# EAGLE design bldc_shield_eagle_layout (EAGLE 7.5.0)

## Sheet 1 of 3
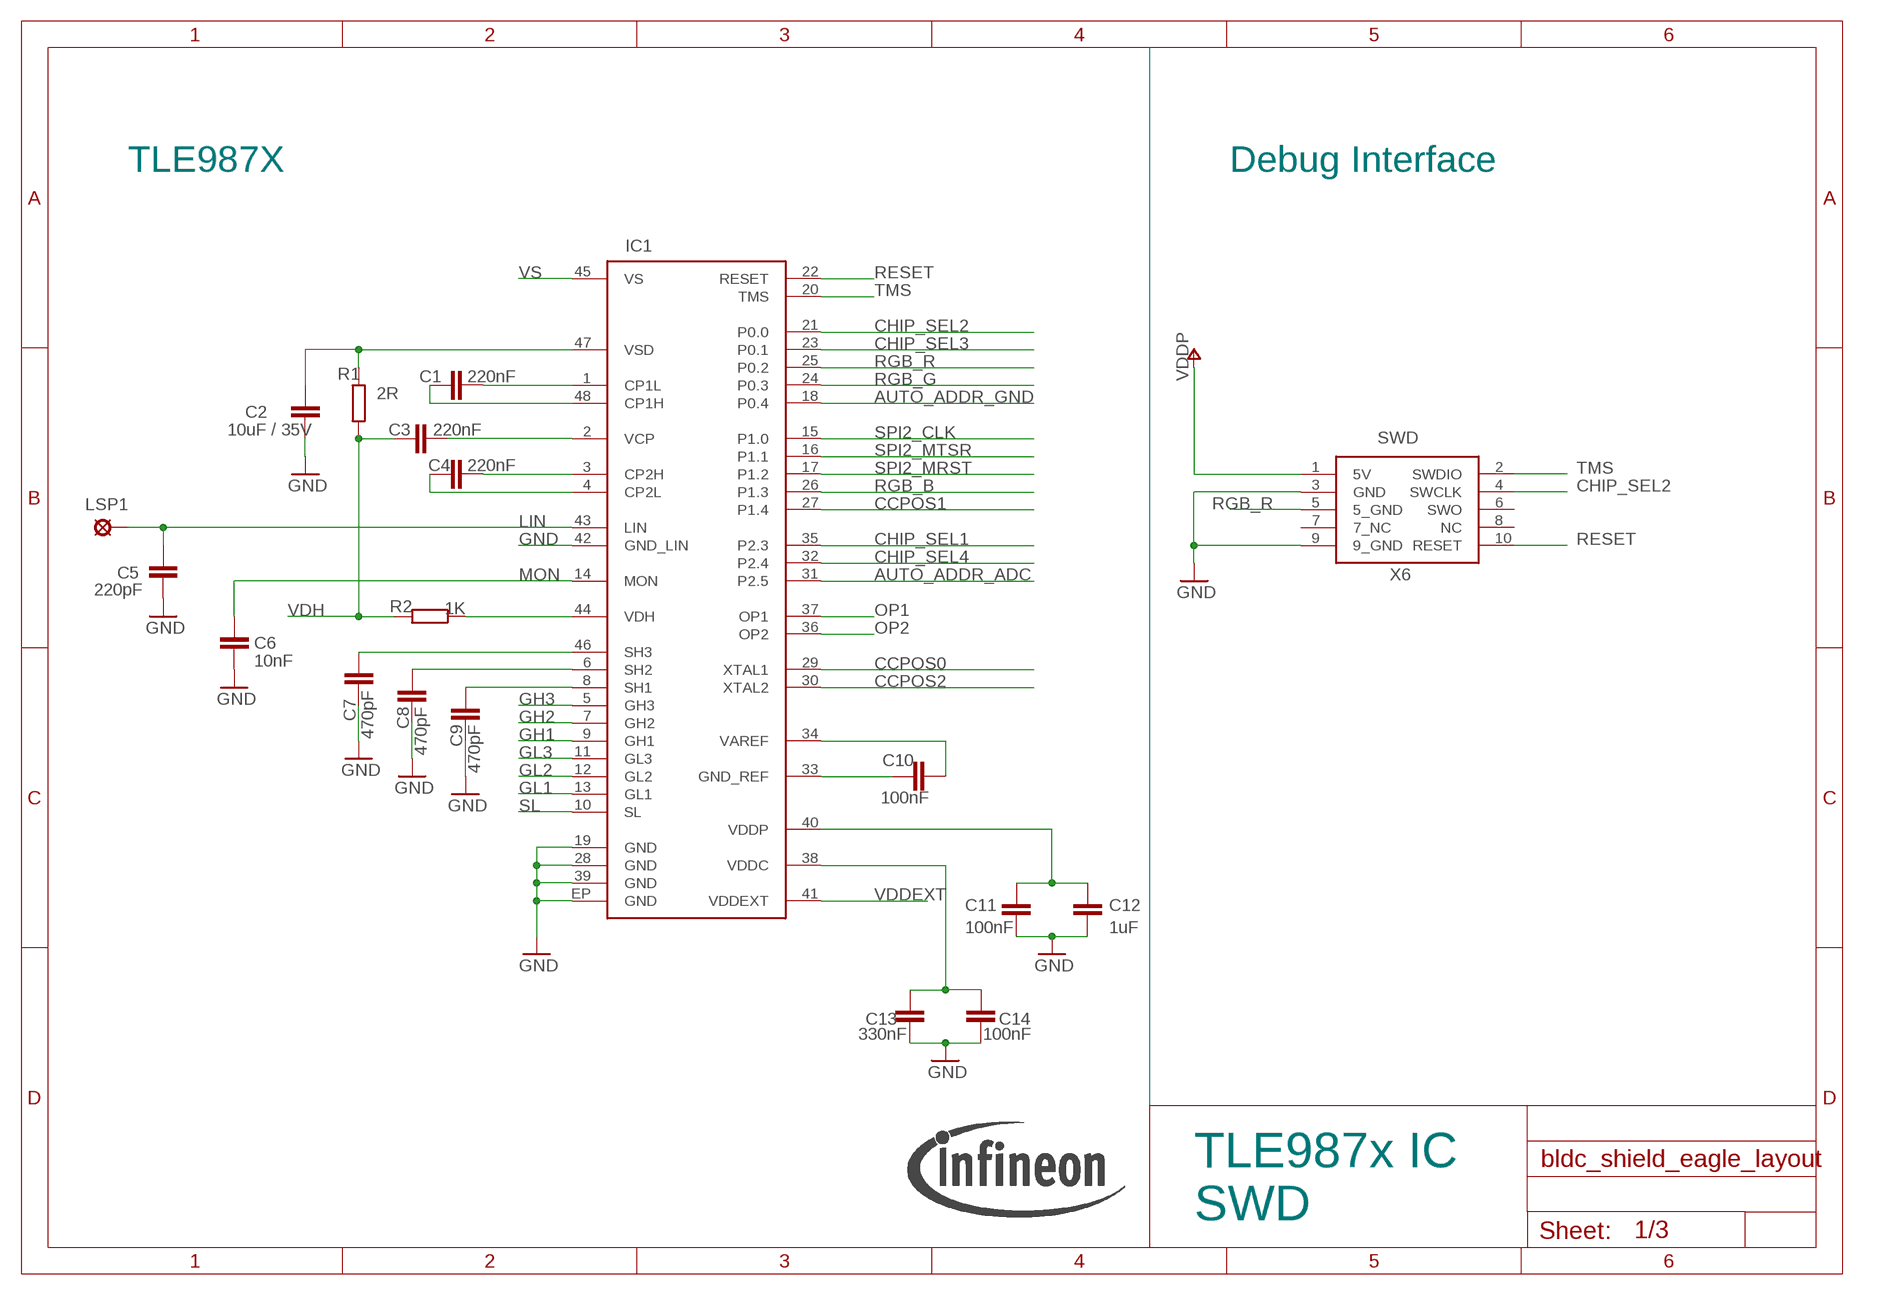
[diagram p0: schematic, sheet 1]

### Parts
C1  220nF  C-EUC0603  [C0603]
C2  10uF / 35V  C-EUC1210  [C1210]
C3  220nF  C-EUC0603  [C0603]
C4  220nF  C-EUC0603  [C0603]
C5  220pF  C-EUC0603  [C0603]
C6  10nF  C-EUC0603  [C0603]
C7  470pF  C-EUC0603  [C0603]
C8  470pF  C-EUC0603  [C0603]
C9  470pF  C-EUC0603  [C0603]
C10  100nF  C-EUC0603  [C0603]
C11  100nF  C-EUC0603  [C0603]
C12  1uF  C-EUC0603  [C0603]
C13  330nF  C-EUC0603  [C0603]
C14  100nF  C-EUC0603  [C0603]
IC1  PROTEUS_EAGLE_TLE9879QX  [VQFN48-15_7X7]
INFINEONLOGO  INFINEON5  [INFINEON_LOGO_5]
LSP1  MCS10B  [MCS10B]
R1  2R  R-EU_R0603  [R0603]
R2  1K  R-EU_R0603  [R0603]
X6  SWD  [FTSH-105-01-L-DH]

### Nets
AUTO_ADDR_ADC: IC1.31(P2.5) ; also sheet 3
AUTO_ADDR_GND: IC1.18(P0.4) ; also sheet 3
CCPOS0: IC1.29(XTAL1) ; also sheet 3
CCPOS1: IC1.27(P1.4) ; also sheet 3
CCPOS2: IC1.30(XTAL2) ; also sheet 3
CHIP_SEL1: IC1.35(P2.3) ; also sheet 3
CHIP_SEL2: IC1.21(P0.0) X6.4(SWCLK) ; also sheet 3
CHIP_SEL3: IC1.23(P0.1) ; also sheet 3
CHIP_SEL4: IC1.32(P2.4) ; also sheet 3
CP1H: C1.2 IC1.48(CP1H)
CP1L: C1.1 IC1.1(CP1L)
CP2H: C4.1 IC1.3(CP2H)
CP2L: C4.2 IC1.4(CP2L)
GH1: IC1.9(GH1) ; also sheet 2
GH2: IC1.7(GH2) ; also sheet 2
GH3: IC1.5(GH3) ; also sheet 2
GL1: IC1.13(GL1) ; also sheet 2
GL2: IC1.12(GL2) ; also sheet 2
GL3: IC1.11(GL3) ; also sheet 2
GND: C2.2 C5.1 C6.1 C7.2 C8.1 C9.1 C11.1 C12.1 C13.1 C14.1 IC1.19(GND) IC1.28(GND) IC1.39(GND) IC1.42(GND_LIN) IC1.EP(GND) X6.3(GND) X6.9(9_GND) ; also sheet 2,3
GND_REF: C10.1 IC1.33(GND_REF)
LIN: C5.2 IC1.43(LIN) LSP1.MP
MON: C6.2 IC1.14(MON)
OP1: IC1.37(OP1) ; also sheet 2
OP2: IC1.36(OP2) ; also sheet 2
RESET: IC1.22(RESET) X6.10(RESET) ; also sheet 3
RGB_B: IC1.26(P1.3) ; also sheet 3
RGB_G: IC1.24(P0.3) ; also sheet 3
RGB_R: IC1.25(P0.2) X6.5(5_GND) ; also sheet 3
SH1: C9.2 IC1.8(SH1) ; also sheet 2
SH2: C8.2 IC1.6(SH2) ; also sheet 2
SH3: C7.1 IC1.46(SH3) ; also sheet 2
SL: IC1.10(SL) ; also sheet 2
SPI2_CLK: IC1.15(P1.0) ; also sheet 3
SPI2_MRST: IC1.17(P1.2) ; also sheet 3
SPI2_MTSR: IC1.16(P1.1) ; also sheet 3
TMS: IC1.20(TMS) X6.2(SWDIO)
VAREF: C10.2 IC1.34(VAREF)
VCP: C3.1 IC1.2(VCP) ; also sheet 3
VDDC: C13.2 C14.2 IC1.38(VDDC)
VDDEXT: IC1.41(VDDEXT) ; also sheet 3
VDDP: C11.2 C12.2 IC1.40(VDDP) X6.1(5V) ; also sheet 3
VDH: C3.2 R1.2 R2.2 ; also sheet 2,3
VDH_CHIP: IC1.44(VDH) R2.1
VS: IC1.45(VS) ; also sheet 3
VSD: C2.1 IC1.47(VSD) R1.1
Unconnected: X6.6(SWO) X6.7(7_NC) X6.8(NC)

### Notes on the sheet
- TLE987X | Debug Interface
- RGB_R
- TLE987x IC
  SWD

## Sheet 2 of 3
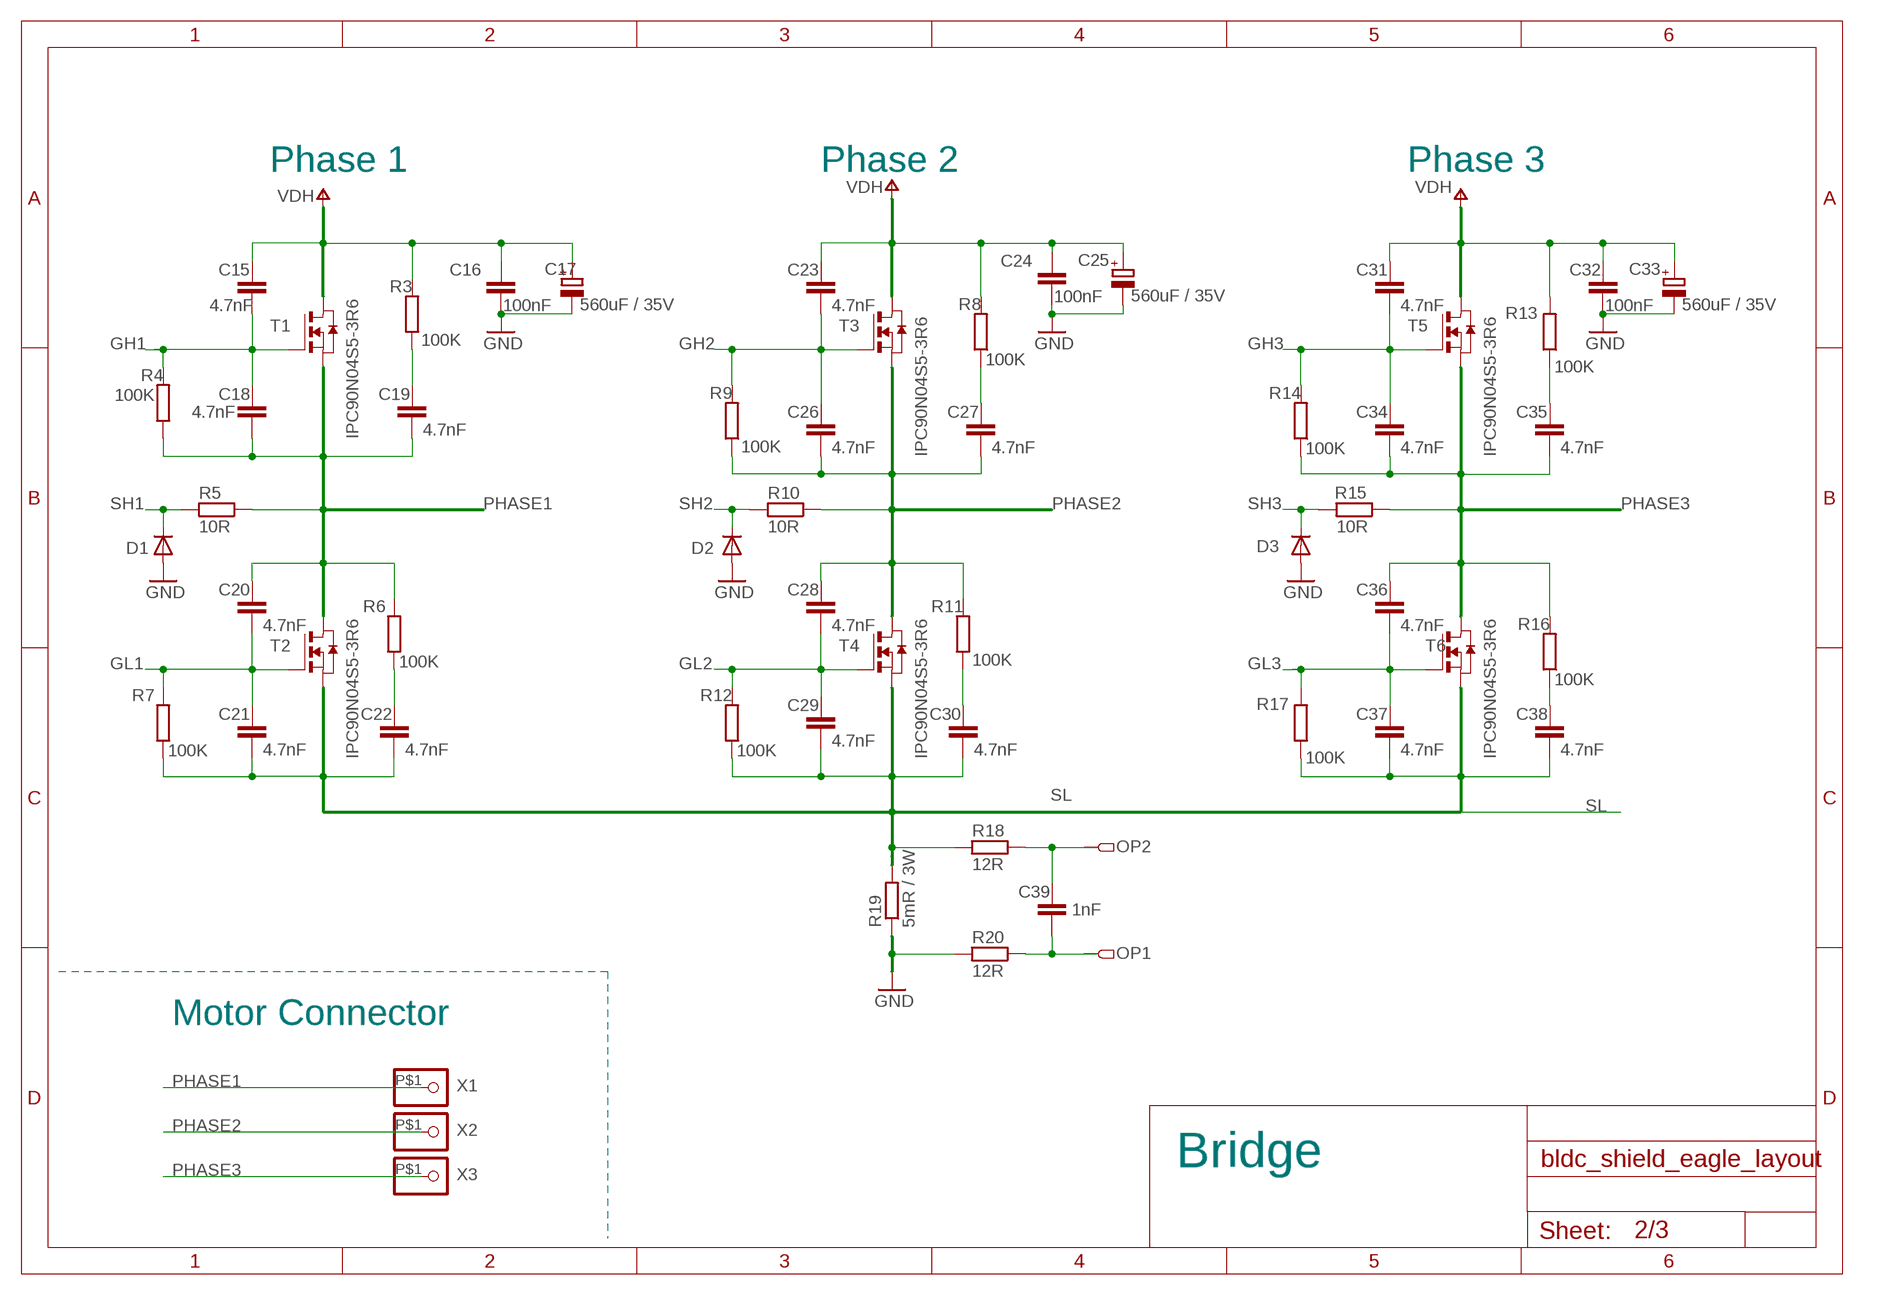
[diagram p1: schematic, sheet 2]

### Parts
C15  4.7nF  C-EUC0603  [C0603]
C16  100nF  C-EUC0603  [C0603]
C17  560uF / 35V  CPOL-EU153CLV-1014  [153CLV-1014]
C18  4.7nF  C-EUC0603  [C0603]
C19  4.7nF  C-EUC0603  [C0603]
C20  4.7nF  C-EUC0603  [C0603]
C21  4.7nF  C-EUC0603  [C0603]
C22  4.7nF  C-EUC0603  [C0603]
C23  4.7nF  C-EUC0603  [C0603]
C24  100nF  C-EUC0603  [C0603]
C25  560uF / 35V  CPOL-EU153CLV-1014  [153CLV-1014]
C26  4.7nF  C-EUC0603  [C0603]
C27  4.7nF  C-EUC0603  [C0603]
C28  4.7nF  C-EUC0603  [C0603]
C29  4.7nF  C-EUC0603  [C0603]
C30  4.7nF  C-EUC0603  [C0603]
C31  4.7nF  C-EUC0603  [C0603]
C32  100nF  C-EUC0603  [C0603]
C33  560uF / 35V  CPOL-EU153CLV-1014  [153CLV-1014]
C34  4.7nF  C-EUC0603  [C0603]
C35  4.7nF  C-EUC0603  [C0603]
C36  4.7nF  C-EUC0603  [C0603]
C37  4.7nF  C-EUC0603  [C0603]
C38  4.7nF  C-EUC0603  [C0603]
C39  1nF  C-EUC0603  [C0603]
D1  DIODE-SOD323-W  [SOD323-W]
D2  DIODE-SOD323-W  [SOD323-W]
D3  DIODE-SOD323-W  [SOD323-W]
R3  100K  R-EU_R0603  [R0603]
R4  100K  R-EU_R0603  [R0603]
R5  10R  R-EU_R0603  [R0603]
R6  100K  R-EU_R0603  [R0603]
R7  100K  R-EU_R0603  [R0603]
R8  100K  R-EU_R0603  [R0603]
R9  100K  R-EU_R0603  [R0603]
R10  10R  R-EU_R0603  [R0603]
R11  100K  R-EU_R0603  [R0603]
R12  100K  R-EU_R0603  [R0603]
R13  100K  R-EU_R0603  [R0603]
R14  100K  R-EU_R0603  [R0603]
R15  10R  R-EU_R0603  [R0603]
R16  100K  R-EU_R0603  [R0603]
R17  100K  R-EU_R0603  [R0603]
R18  12R  R-EU_R0603  [R0603]
R19  5mR / 3W  R-EU_R6332  [R6332]
R20  12R  R-EU_R0603  [R0603]
T1  IPC90N04S5-3R6  [PG-TDSON-8]
T2  IPC90N04S5-3R6  [PG-TDSON-8]
T3  IPC90N04S5-3R6  [PG-TDSON-8]
T4  IPC90N04S5-3R6  [PG-TDSON-8]
T5  IPC90N04S5-3R6  [PG-TDSON-8]
T6  IPC90N04S5-3R6  [PG-TDSON-8]
X1  SCREWHOLE  [SCREWHOLE]
X2  SCREWHOLE  [SCREWHOLE]
X3  SCREWHOLE  [SCREWHOLE]

### Nets
GH1: C15.2 C18.1 R4.2 T1.4(G) ; also sheet 1
GH2: C23.2 C26.1 R9.2 T3.4(G) ; also sheet 1
GH3: C31.2 C34.1 R14.2 T5.4(G) ; also sheet 1
GL1: C20.2 C21.1 R7.2 T2.4(G) ; also sheet 1
GL2: C28.2 C29.1 R12.2 T4.4(G) ; also sheet 1
GL3: C36.2 C37.1 R17.2 T6.4(G) ; also sheet 1
GND: C16.2 C17.- C24.2 C25.- C32.2 C33.- D1.A D2.A D3.A R19.1 R20.2 ; also sheet 1,3
N$1: C19.1 R3.1
N$2: C22.1 R6.1
N$4: C27.1 R8.1
N$5: C30.1 R11.1
N$6: C38.1 R16.1
N$7: C35.1 R13.1
OP1: C39.2 R20.1 ; also sheet 1
OP2: C39.1 R18.1 ; also sheet 1
PHASE1: C18.2 C19.2 C20.1 R4.1 R5.1 R6.2 T1.1(S) T1.2(S) T1.3(S) T2.5(D) T2.6(D) T2.7(D) T2.8(D) T2.D X1.P$1
PHASE2: C26.2 C27.2 C28.1 R9.1 R10.1 R11.2 T3.1(S) T3.2(S) T3.3(S) T4.5(D) T4.6(D) T4.7(D) T4.8(D) T4.D X2.P$1
PHASE3: C34.2 C35.2 C36.1 R14.1 R15.1 R16.2 T5.1(S) T5.2(S) T5.3(S) T6.5(D) T6.6(D) T6.7(D) T6.8(D) T6.D X3.P$1
SH1: D1.C R5.2 ; also sheet 1
SH2: D2.C R10.2 ; also sheet 1
SH3: D3.C R15.2 ; also sheet 1
SL: C21.2 C22.2 C29.2 C30.2 C37.2 C38.2 R7.1 R12.1 R17.1 R18.2 R19.2 T2.1(S) T2.2(S) T2.3(S) T4.1(S) T4.2(S) T4.3(S) T6.1(S) T6.2(S) T6.3(S) ; also sheet 1
VDH: C15.1 C16.1 C17.+ C23.1 C24.1 C25.+ C31.1 C32.1 C33.+ R3.2 R8.2 R13.2 T1.5(D) T1.6(D) T1.7(D) T1.8(D) T1.D T3.5(D) T3.6(D) T3.7(D) T3.8(D) T3.D T5.5(D) T5.6(D) T5.7(D) T5.8(D) T5.D ; also sheet 1,3

### Notes on the sheet
- Phase 1 | Phase 2 | Phase 3
- Motor Connector
- Bridge

## Sheet 3 of 3
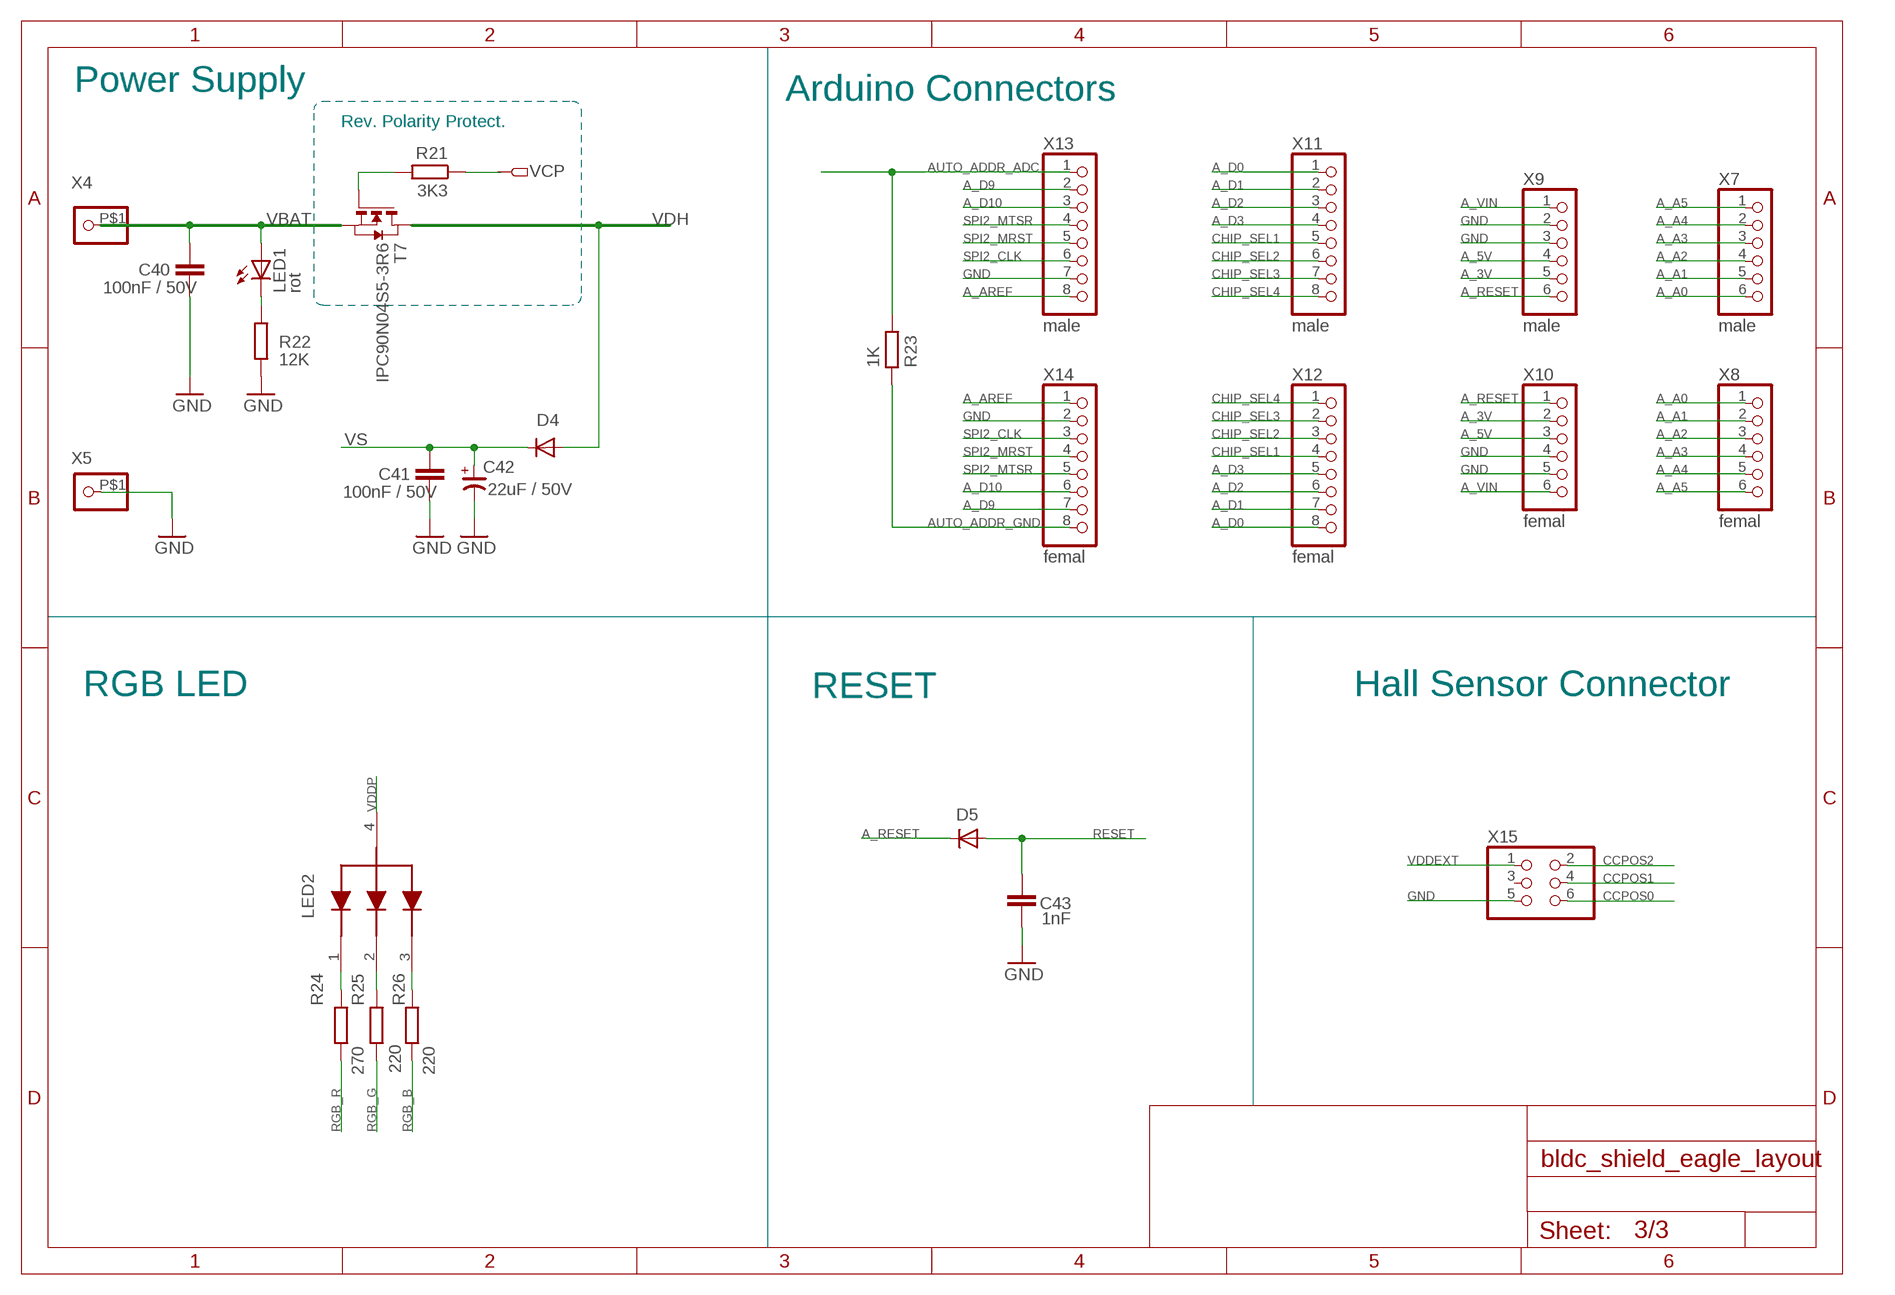
[diagram p2: schematic, sheet 3]

### Parts
C40  100nF / 50V  C-EUC0603  [C0603]
C41  100nF / 50V  C-EUC0603  [C0603]
C42  22uF / 50V  CP-153CLV-0505  [153CLV-0505]
C43  1nF  C-EUC0603  [C0603]
D4  DIODE_DIODE-SOD123  [DIODE_SOD123]
D5  DIODE-SOD323-W  [SOD323-W]
LED1  rot  LEDSML0603  [SML0603]
LED2  RGB_LED  [LTST-C19HE1WT]
R21  3K3  R-EU_R0603  [R0603]
R22  12K  R-EU_R0603  [R0603]
R23  1K  R-EU_R0603  [R0603]
R24  270  R-EU_R0603  [R0603]
R25  220  R-EU_R0603  [R0603]
R26  220  R-EU_R0603  [R0603]
T7  IPC90N04S5-3R6  [PG-TDSON-8]
X4  SCREWHOLE  [SCREWHOLE]
X5  SCREWHOLE  [SCREWHOLE]
X7  male  PINHD-1X6_2.54-SMD  [1X06SMD]
X8  femal  PINHD-1X6_2.54-SMD-FEMAL  [1X06SMD-FEMAL]
X9  male  PINHD-1X6_2.54-SMD  [1X06SMD]
X10  femal  PINHD-1X6_2.54-SMD-FEMAL  [1X06SMD-FEMAL]
X11  male  PINHD-1X8_2.54-SMD  [1X08SMD]
X12  femal  PINHD-1X8_2.54-FEMAL  [1X08SMD-FEMAL]
X13  male  PINHD-1X8_2.54-SMD  [1X08SMD]
X14  femal  PINHD-1X8_2.54-FEMAL  [1X08SMD-FEMAL]
X15  PINHD-2X3_2.54-90°  [2X03/90]

### Nets
A_3V: X9.5 X10.2
A_5V: X9.4 X10.3
A_A0: X7.6 X8.1
A_A1: X7.5 X8.2
A_A2: X7.4 X8.3
A_A3: X7.3 X8.4
A_A4: X7.2 X8.5
A_A5: X7.1 X8.6
A_AREF: X13.8 X14.1
A_D0: X11.1 X12.8
A_D1: X11.2 X12.7
A_D2: X11.3 X12.6
A_D3: X11.4 X12.5
A_D9: X13.2 X14.7
A_D10: X13.3 X14.6
A_RESET: D5.C X9.6 X10.1
A_VIN: X9.1 X10.6
AUTO_ADDR_ADC: R23.2 X13.1 ; also sheet 1
AUTO_ADDR_GND: R23.1 X14.8 ; also sheet 1
CCPOS0: X15.6 ; also sheet 1
CCPOS1: X15.4 ; also sheet 1
CCPOS2: X15.2 ; also sheet 1
CHIP_SEL1: X11.5 X12.4 ; also sheet 1
CHIP_SEL2: X11.6 X12.3 ; also sheet 1
CHIP_SEL3: X11.7 X12.2 ; also sheet 1
CHIP_SEL4: X11.8 X12.1 ; also sheet 1
GND: C40.2 C41.2 C42.- C43.1 R22.2 X5.P$1 X9.2 X9.3 X10.4 X10.5 X13.7 X14.2 X15.5 ; also sheet 1,2
N$3: LED2.2 R25.1
N$9: LED2.1 R24.1
N$10: LED2.3 R26.1
N$12: R21.2 T7.4(G)
N$51: LED1.C R22.1
RESET: C43.2 D5.A ; also sheet 1
RGB_B: R26.2 ; also sheet 1
RGB_G: R25.2 ; also sheet 1
RGB_R: R24.2 ; also sheet 1
SPI2_CLK: X13.6 X14.3 ; also sheet 1
SPI2_MRST: X13.5 X14.4 ; also sheet 1
SPI2_MTSR: X13.4 X14.5 ; also sheet 1
VBAT: C40.1 LED1.A T7.1(S) T7.2(S) T7.3(S) X4.P$1
VCP: R21.1 ; also sheet 1
VDDEXT: X15.1 ; also sheet 1
VDDP: LED2.4 ; also sheet 1
VDH: D4.A T7.5(D) T7.6(D) T7.7(D) T7.8(D) T7.D ; also sheet 1,2
VS: C41.1 C42.+ D4.C ; also sheet 1
Unconnected: X15.3

### Notes on the sheet
- Power Supply | Arduino Connectors
- Rev. Polarity Protect.
- RGB LED | RESET | Hall Sensor Connector

## Library data of the parts
C1 C3-C14 C16 C24 C32 C39 C43 = rcl:C-EU: CAPACITOR, European symbol
C2 = rcl:C-EU: CAPACITOR, European symbol; FARNELL: 2112703RL
C15 C18-C23 C26-C31 C34-C38 = rcl:C-EU: CAPACITOR, European symbol; NB: nB
C17 C25 C33 = rcl:CPOL-EU: POLARIZED CAPACITOR, European symbol; FARNELL: 2408677
C40 C41 = rcl:C-EU: CAPACITOR, European symbol; FARNELL: 1740621
C42 = cap-master:CP-: POLARIZED CAP; FARNELL: 2408669
D1-D3 D5 = diode:DIODE-: DIODE
D4 = EvalBoardTLE987x_V1.2:DIODE_DIODE-: DIODE
IC1 = EvalBoardTLE987x_V1.2:PROTEUS_EAGLE_TLE9879QX
INFINEONLOGO = infineon_logo:INFINEON
LED1 = led:LED: LED OSRAM: - CHIPLED LG R971, LG N971, LY N971, LG Q971, LY Q971, LO R971, LY R971 LH N974, LH R974 LS Q976, LO Q976, LY Q976 LO Q996 - Hyper CHIPLED LW Q18S LB Q993, LB Q99A, LB R99A - SideLED LS A670, LO A670, LY A670, LG A670, LP A670 LB A673, LV A673, LT A673, LW A673 LH A674 LY A675 LS A676, LA A676, LO A676, LY A676, LW A676 LS A679, LY A679, LG A679 - Hyper Micro SIDELED® LS Y876, LA Y876, LO Y876, LY Y876 LT Y87S - SmartLED LW L88C, LW L88S LB L89C, LB L89S, LG L890 LS L89K, LO L89K, LY L89K LS L896, LA L896, LO L896, LY L896 - TOPLED LS T670, LO T670, LY T670, LG T670, LP T670 LSG T670, LSP T670, LSY T670, LOP T670, LYG T670 LG T671, LOG T671, LSG T671 LB T673, LV T673, LT T673, LW T673 LH T674 LS T676, LA T676, LO T676, LY T676, LB T676, LH T676, LSB T676, LW T676 LB T67C, LV T67C, LT T67C, LS T67K, LO T67K, LY T67K, LW E67C LS E67B, LA E67B, LO E67B, LY E67B, LB E67C, LV E67C, LT E67C LW T67C LS T679, LY T679, LG T679 LS T770, LO T770, LY T770, LG T770, LP T770 LB T773, LV T773, LT T773, LW T773 LH T774 LS E675, LA E675, LY E675, LS T675 LS T776, LA T776, LO T776, LY T776, LB T776 LHGB T686 LT T68C, LB T68C - Hyper Mini TOPLED® LB M676 - Mini TOPLED Santana® LG M470 LS M47K, LO M47K, LY M47K Source: http://www.osram.convergy.de LUXEON: - LUMILED® LXK2-PW12-R00, LXK2-PW12-S00, LXK2-PW14-U00, LXK2-PW14-V00 LXK2-PM12-R00, LXK2-PM12-S00, LXK2-PM14-U00 LXK2-PE12-Q00, LXK2-PE12-R00, LXK2-PE12-S00, LXK2-PE14-T00, LXK2-PE14-U00 LXK2-PB12-K00, LXK2-PB12-L00, LXK2-PB12-M00, LXK2-PB14-N00, LXK2-PB14-P00, LXK2-PB14-Q00 LXK2-PR12-L00, LXK2-PR12-M00, LXK2-PR14-Q00, LXK2-PR14-R00 LXK2-PD12-Q00, LXK2-PD12-R00, LXK2-PD12-S00 LXK2-PH12-R00, LXK2-PH12-S00 LXK2-PL12-P00, LXK2-PL12-Q00, LXK2-PL12-R00 Source: www.luxeon.com KINGBRIGHT: KA-3528ASYC Source: www.kingbright.com; FARNELL: 2112124
LED2 = MichaelSchubert:RGB_LED
LSP1 = solpad:MCS10B: SOLDER PAD MC S1, distributor Buerklin, 15F505; NB: nB
R1 R2 R5 R10 R15 R18-R26 = rcl:R-EU_: RESISTOR, European symbol
R3 R4 R6-R9 R11-R14 R16 R17 = rcl:R-EU_: RESISTOR, European symbol; NB: nB
T1-T7 = PG-TDSON-8:IPC90N04S5-3R6
X1-X5 = MichaelSchubert:SCREWHOLE
X6 = ePower_SBC:SWD; NB: nB
X7 X9 = pinheadsmd:PINHD-1X6: PIN HEADER; SAMTEC: TSM-106-03-L-SV
X8 X10 = pinheadsmd:PINHD-1X6: PIN HEADER; SAMTEC: SSM-106-L-SV
X11 X13 = pinheadsmd:PINHD-1X8: PIN HEADER; SAMTEC: TSM-108-03-L-SV
X12 X14 = pinheadsmd:PINHD-1X8: PIN HEADER; SAMTEC: SSM-108-L-SV
X15 = pinheadsmd:PINHD-2X3: PIN HEADER; NB: nb

## Board
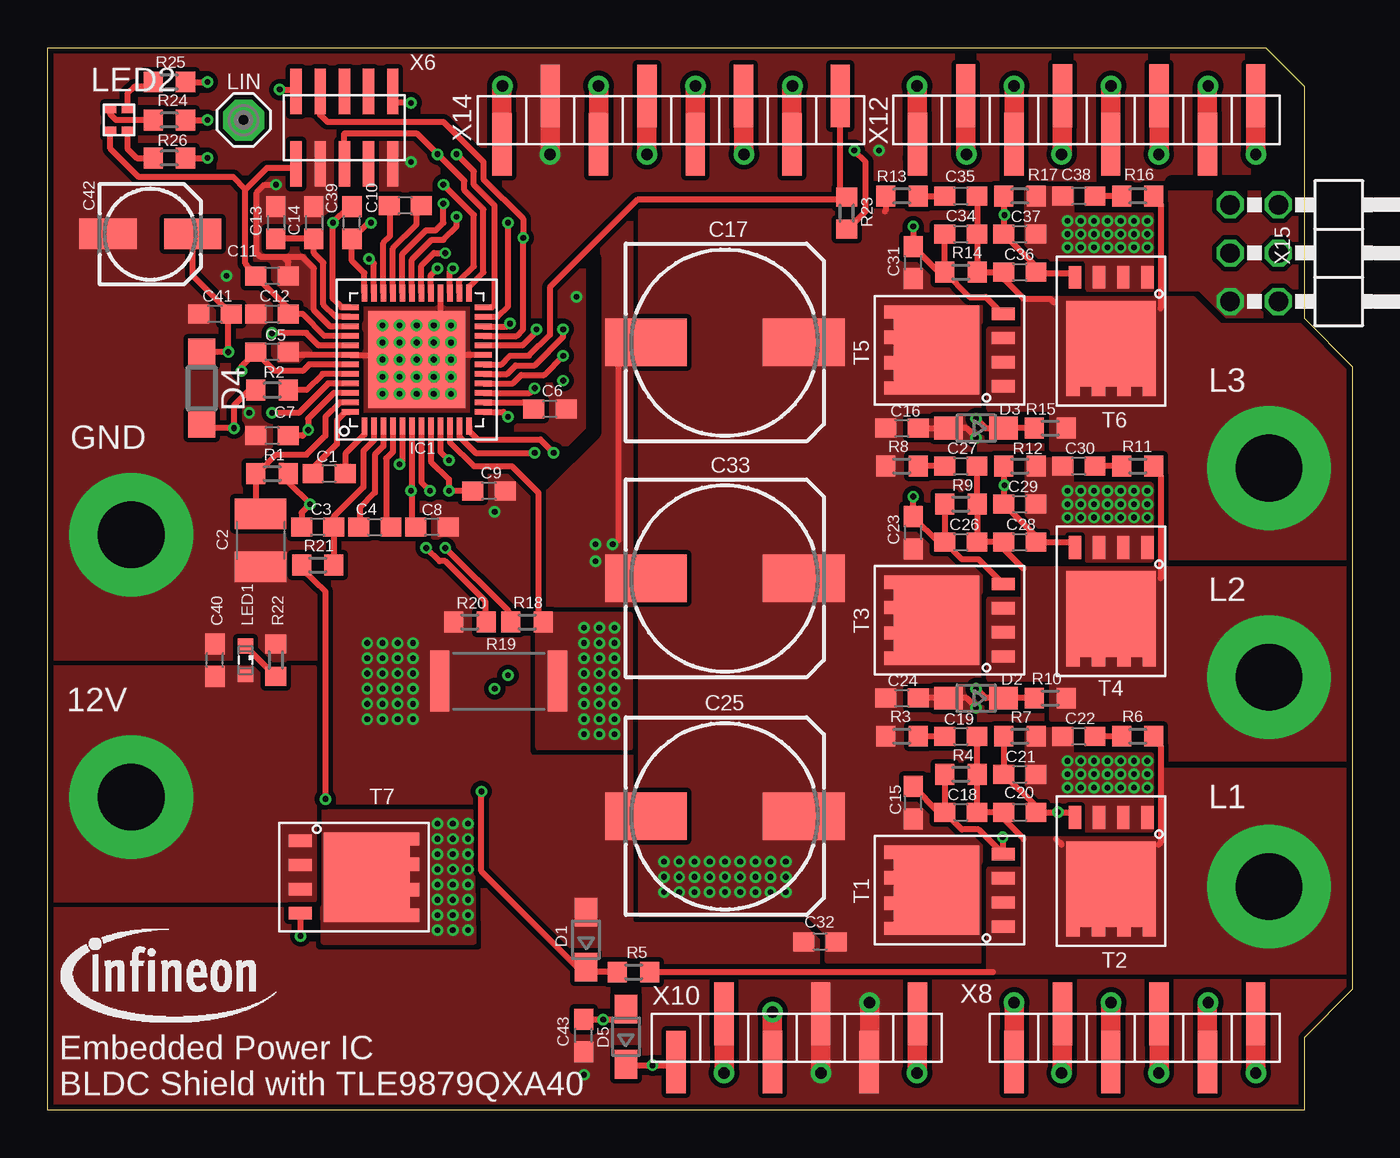
[diagram p3: board, top side]
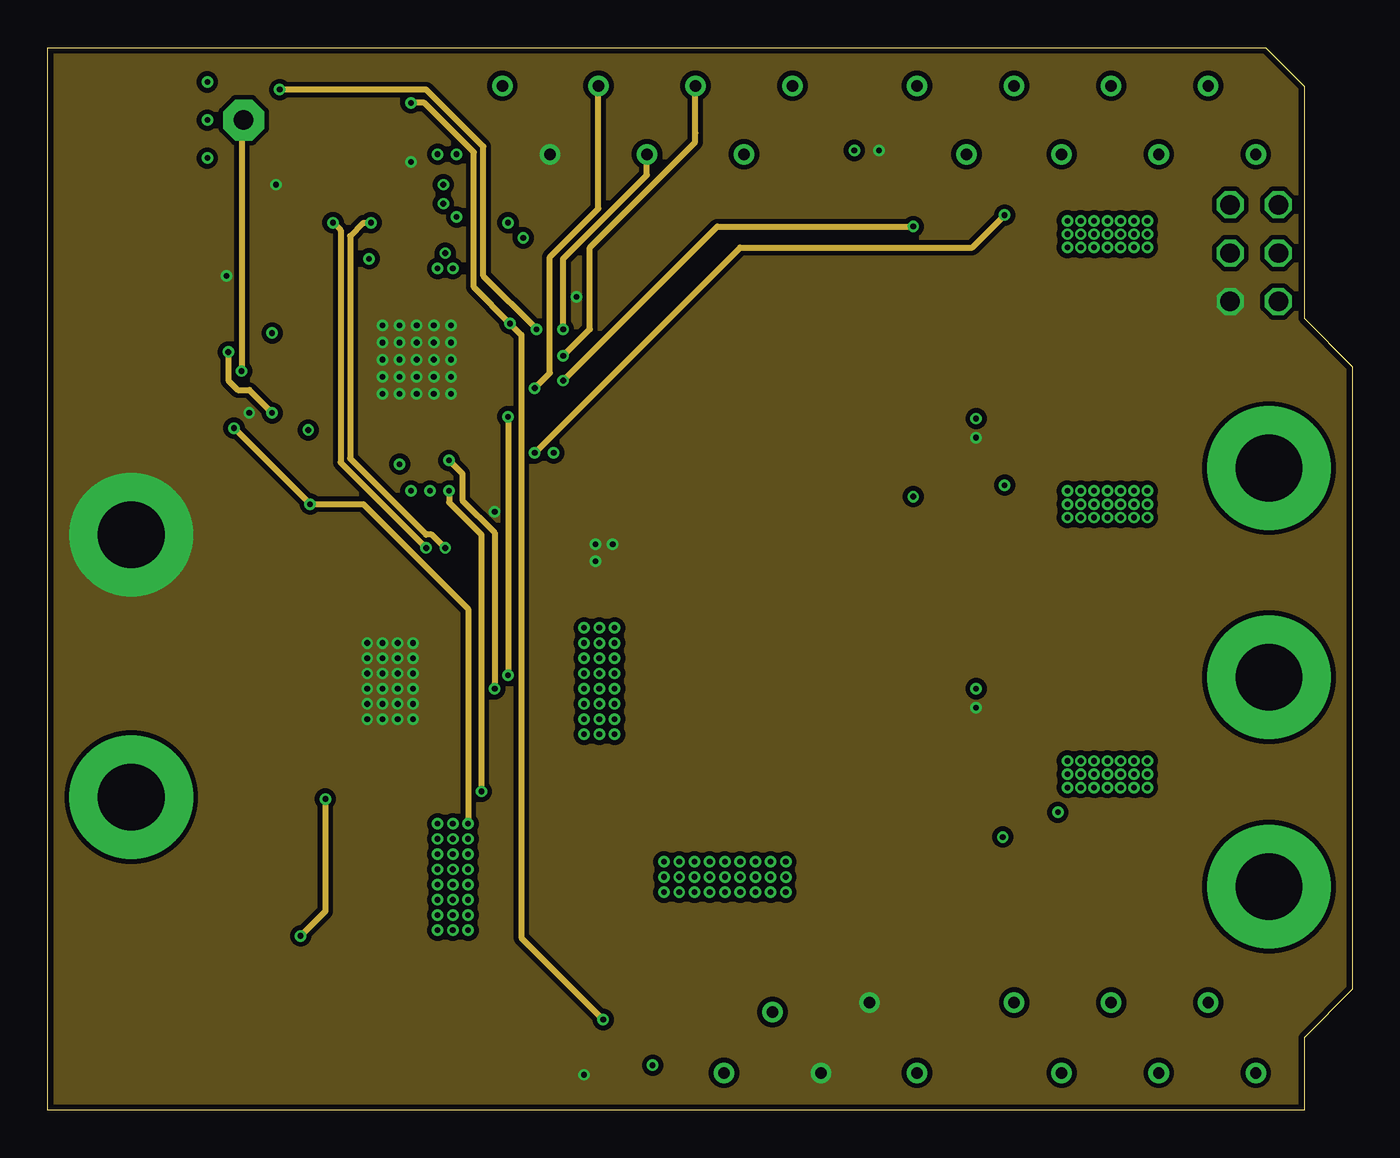
[diagram p4: board, inner layer Middle]
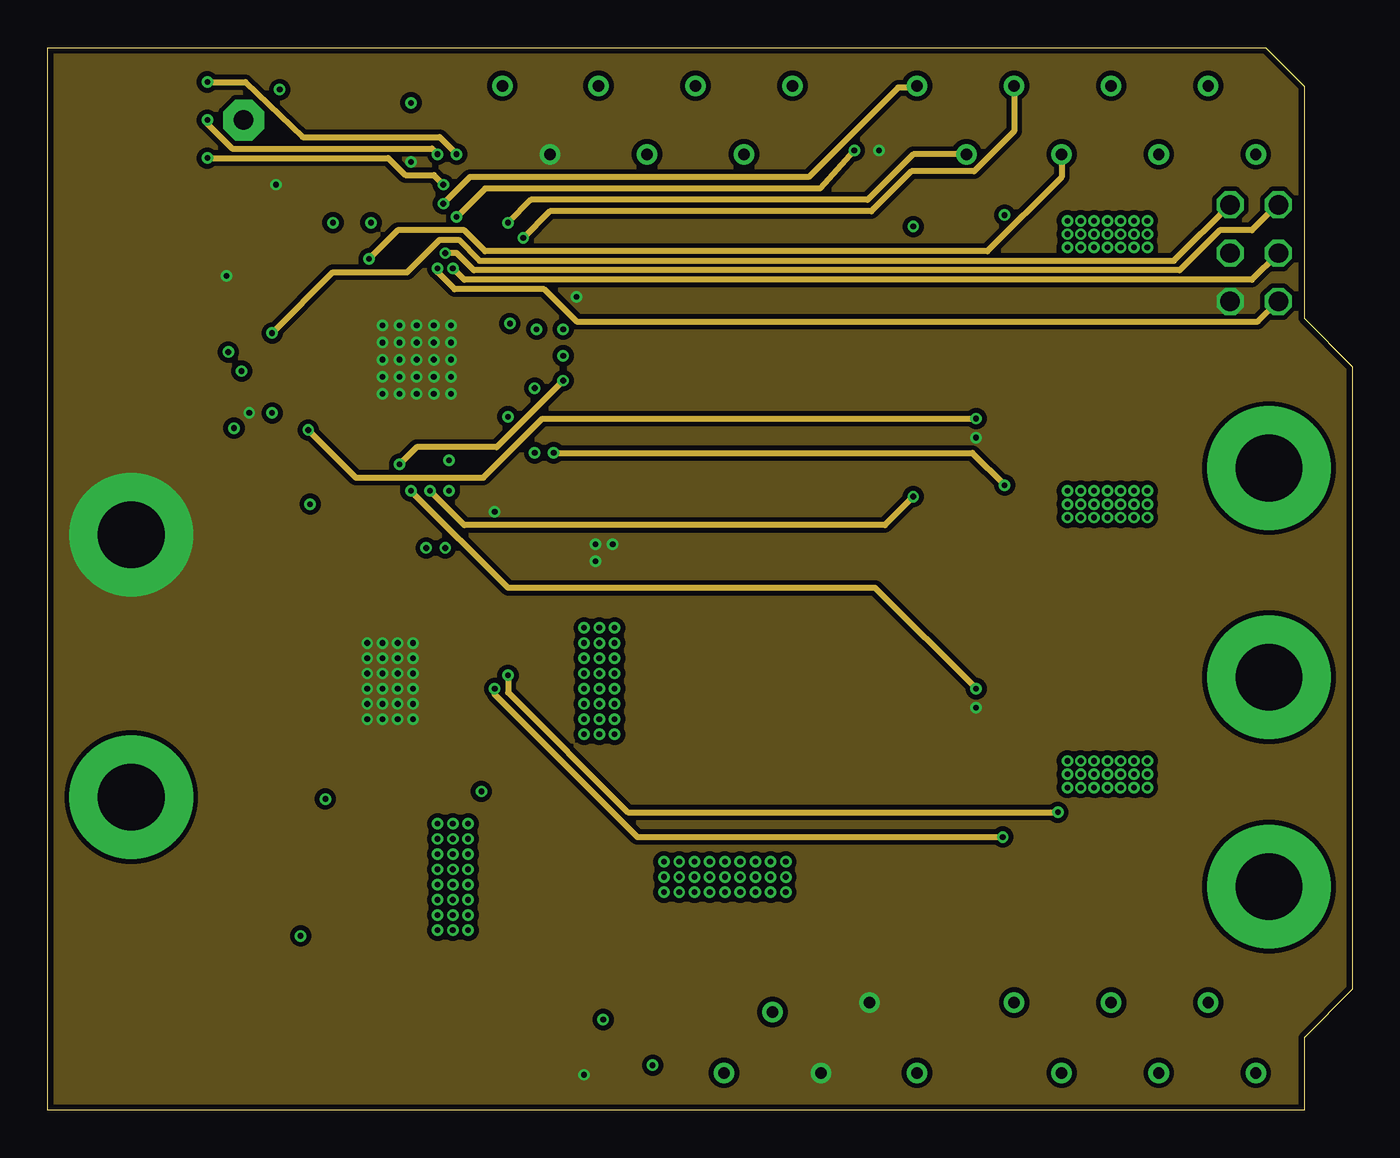
[diagram p5: board, inner layer MiddleDown]
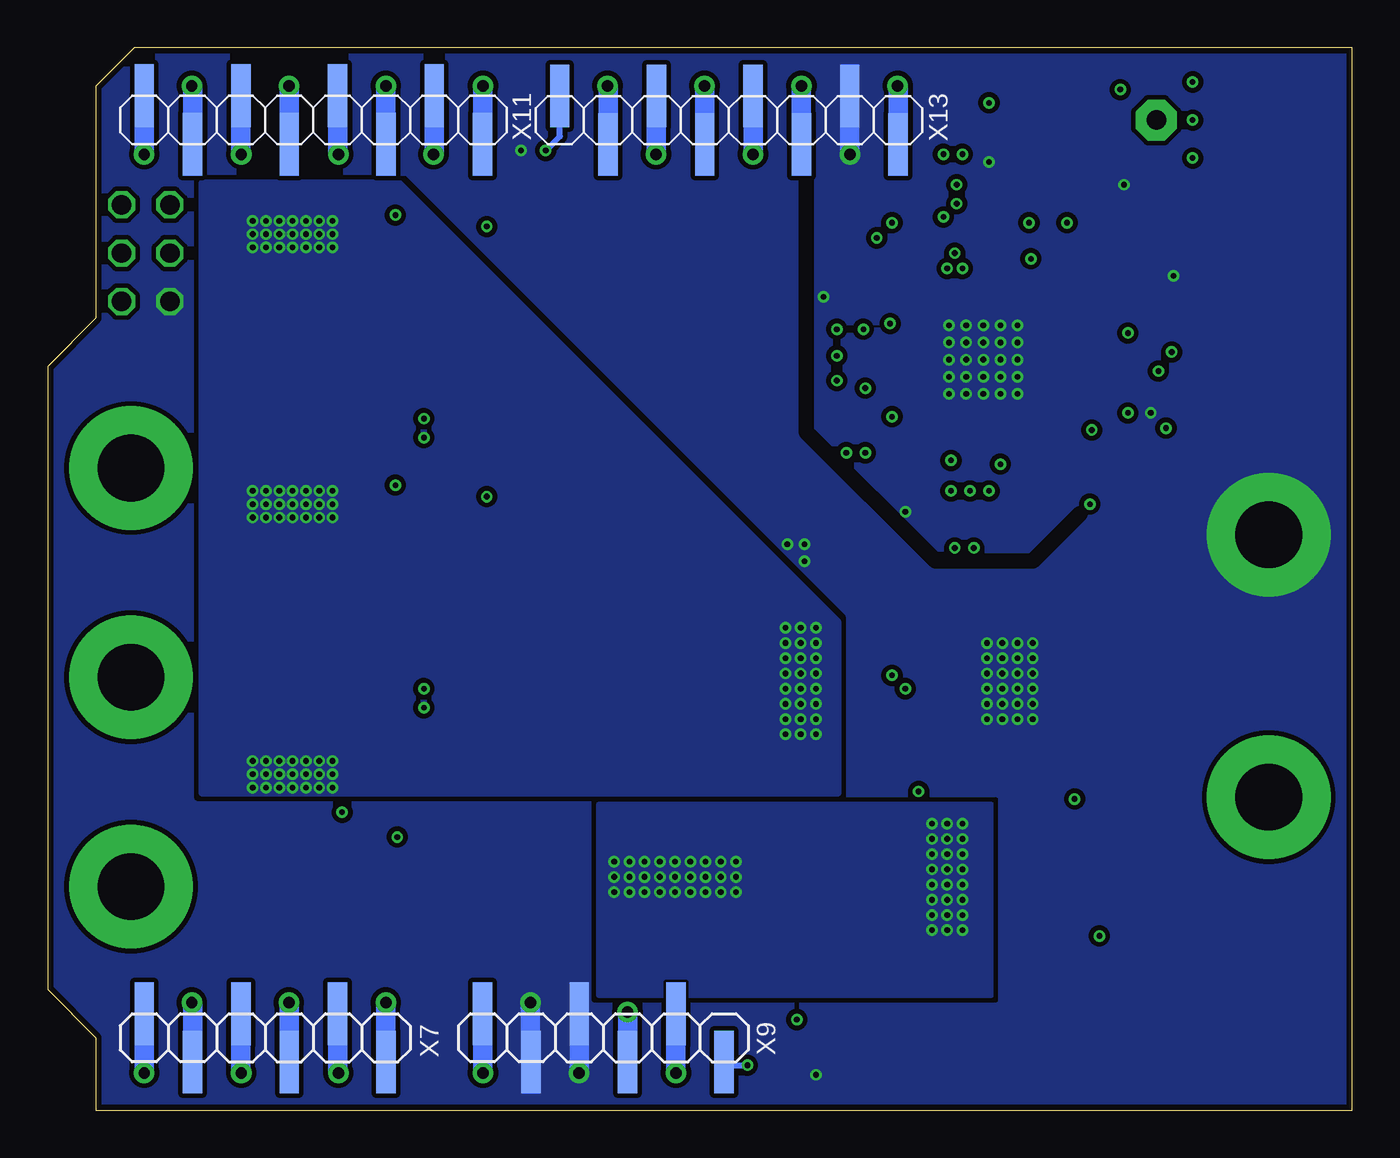
[diagram p6: board, bottom side, seen from below]

Size 68.58 x 55.88 mm. Coordinates in mm from the lower left corner, seen from the top.
Outline: 0,0 0,55.88 64.02,55.88 66.04,53.86 66.04,41.66 68.58,39.12 68.58,6.35 66.04,3.81 66.04,0 0,0
Copper layers (1*2*3*16): Top 0.07mm / dielectric 0.5mm / Middle 0.035mm / dielectric 0.5mm / MiddleDown 0.035mm / dielectric 0.5mm / Bottom 0.07mm
Design rules "PCB-POOL Standard *": minimum track width 0.15mm, minimum drill 0.3mm, track to track 0.15mm, track to pad 0.15mm, pad to pad 0.15mm, via to via 0.15mm, smd to smd 0.15mm, copper to edge 0.3mm, drill to drill 0.2mm, minimum pad ring 0.2mm, minimum via ring 0.15mm, stop-mask expansion 0.075mm, vias tented up to drill 0mil, thermal gap 0.2mm
tRestrict: 3 lines
bRestrict: 4 lines

### Footprints (pad centres in the part's own frame; a part is rotated, then mirrored left to right if it is on the bottom)
C0603 = smd 1.1 x 1: 1 -0.85,0; 2 0.85,0
C1210 = smd 1.6 x 2.7: 1 -1.4,0; 2 1.4,0
153CLV-1014 = smd 4.3 x 2.5: + 4.15,0; - -4.15,0
153CLV-0505 = smd 3 x 1.6: + 2.223,0; - -2.223,0
SOD323-W = smd 1.5 x 1.2: A 1.45,0; C -1.45,0
DIODE_SOD123 = smd 1.4 x 1.4: A 1.9,0; C -1.9,0
VQFN48-15_7X7 = smd 0.29 x 0.9: 1 -2.75,-3.5; 2 -2.25,-3.5; 3 -1.75,-3.5; 4 -1.25,-3.5; 5 -0.75,-3.5; 6 -0.25,-3.5; 7 0.25,-3.5; 8 0.75,-3.5; 9 1.25,-3.5; 10 1.75,-3.5; 11 2.25,-3.5; 12 2.75,-3.5; 25 2.75,3.5; 26 2.25,3.5; 27 1.75,3.5; 28 1.25,3.5; 29 0.75,3.5; 30 0.25,3.5; 31 -0.25,3.5; 32 -0.75,3.5; 33 -1.25,3.5; 34 -1.75,3.5; 35 -2.25,3.5; 36 -2.75,3.5 | smd 0.9 x 0.29: 13 3.5,-2.75; 14 3.5,-2.25; 15 3.5,-1.75; 16 3.5,-1.25; 17 3.5,-0.75; 18 3.5,-0.25; 19 3.5,0.25; 20 3.5,0.75; 21 3.5,1.25; 22 3.5,1.75; 23 3.5,2.25; 24 3.5,2.75; 37 -3.5,2.75; 38 -3.5,2.25; 39 -3.5,1.75; 40 -3.5,1.25; 41 -3.5,0.75; 42 -3.5,0.25; 43 -3.5,-0.25; 44 -3.5,-0.75; 45 -3.5,-1.25; 46 -3.5,-1.75; 47 -3.5,-2.25; 48 -3.5,-2.75 | smd 5.08 x 5.08: EP 0,0
SML0603 = smd 0.8 x 0.8: A 0.75,0; C -0.75,0
LTST-C19HE1WT = smd 0.6 x 0.5: 1 -0.45,0.6; 2 0.45,0.6; 3 0.45,-0.6; 4 -0.45,-0.6
MCS10B = drill 1.016 pad 2.159 octagon: MP 0,0
R0603 = smd 1 x 1.1: 1 -0.85,0; 2 0.85,0
R6332 = smd 1 x 3.2: 1 -3.1,0; 2 3.1,0
PG-TDSON-8 = smd 0.65 x 1.2: 1 -1.905,-2.825; 2 -0.635,-2.825; 3 0.635,-2.825; 4 1.905,-2.825 | smd 0.7 x 1.27: 5 2,2.79; 6 0.67,2.79; 7 -0.67,2.79; 8 -2,2.79 | smd 4.7 x 4.5: D 0,0.675
SCREWHOLE = drill 3.5 pad 6.5: P$1 0,0
FTSH-105-01-L-DH = smd 2.4 x 0.6: 1 -1.905,2.54; 2 1.905,2.54; 3 -1.905,1.27; 4 1.905,1.27; 5 -1.905,0; 6 1.905,0; 7 -1.905,-1.27; 8 1.905,-1.27; 9 -1.905,-2.54; 10 1.905,-2.54
1X06SMD = smd 1.016 x 3.302: 1 -1.27,1.27; 2 1.27,-1.27; 3 3.81,1.27; 4 6.35,-1.27; 5 8.89,1.27; 6 11.43,-1.27
1X06SMD-FEMAL = smd 1.016 x 3.302: 1 0,-1.27; 2 2.54,1.27; 3 5.08,-1.27; 4 7.62,1.27; 5 10.16,-1.27; 6 12.7,1.27
1X08SMD = smd 1.016 x 3.302: 1 -1.27,1.27; 2 1.27,-1.27; 3 3.81,1.27; 4 6.35,-1.27; 5 8.89,1.27; 6 11.43,-1.27; 7 13.97,1.27; 8 16.51,-1.27
1X08SMD-FEMAL = smd 1.016 x 3.302: 1 0,-1.27; 2 2.54,1.27; 3 5.08,-1.27; 4 7.62,1.27; 5 10.16,-1.27; 6 12.7,1.27; 7 15.24,-1.27; 8 17.78,1.27
2X03/90 = drill 1.016 octagon: 1 -2.54,-6.35; 2 -2.54,-3.81; 3 0,-6.35; 4 0,-3.81; 5 2.54,-6.35; 6 2.54,-3.81

### Placement (x,y rotation side)
C1  14.8,33.47 180 top
C2  11.2,29.97 270 top
C3  14.2,30.67 180 top
C4  17.2,30.67 0 top
C5  11.8,39.87 180 top
C6  26.4,36.87 180 top
C7  11.8,35.47 180 top
C8  20.2,30.67 180 top
C9  23.2,32.57 180 top
C10  18.8,47.57 180 top
C11  11.8,43.87 180 top
C12  11.8,41.87 0 top
C13  12,46.67 270 top
C14  14,46.67 270 top
C15  45.5,16.17 90 top
C16  44.9,35.87 0 top
C17  35.6,40.37 0 top
C18  48,15.67 0 top
C19  48,19.67 0 top
C20  51.1,15.67 0 top
C21  51.1,17.67 0 top
C22  54.2,19.67 180 top
C23  45.5,30.37 90 top
C24  44.9,21.67 0 top
C25  35.6,15.47 0 top
C26  48,29.87 0 top
C27  48,33.87 0 top
C28  51.1,29.87 0 top
C29  51.1,31.87 0 top
C30  54.2,33.87 180 top
C31  45.5,44.57 90 top
C32  40.6,8.87 180 top
C33  35.6,27.97 0 top
C34  48,46.07 0 top
C35  48,48.07 0 top
C36  51.1,44.07 0 top
C37  51.1,46.07 0 top
C38  54.2,48.07 180 top
C39  16,46.67 90 top
C40  8.8,23.67 90 top
C41  8.8,41.87 180 top
C42  5.4,46.07 0 top
C43  28.17,3.94 90 top
D1  28.3,8.97 90 top
D2  48.8,21.67 180 top
D3  48.8,35.87 180 top
D4  8.1,37.97 270 top
D5  30.4,3.87 90 top
IC1  19.4,39.47 0 top
INFINEONLOGO  0.29,4.22 0 top
LED1  10.4,23.67 270 top
LED2  3.75,52.07 0 top
LSP1  10.3,52.07 0 top
R1  11.8,33.47 0 top
R2  11.8,37.87 180 top
R3  44.9,19.67 180 top
R4  48,17.67 180 top
R5  30.8,7.27 180 top
R6  57.3,19.67 0 top
R7  51.1,19.67 180 top
R8  44.9,33.87 180 top
R9  48,31.87 180 top
R10  52.7,21.67 180 top
R11  57.3,33.87 0 top
R12  51.1,33.87 180 top
R13  44.9,48.07 180 top
R14  48,44.07 180 top
R15  52.7,35.87 180 top
R16  57.3,48.07 0 top
R17  51.1,48.07 180 top
R18  25.2,25.67 0 top
R19  23.7,22.57 0 top
R20  22.2,25.67 180 top
R21  14.2,28.67 180 top
R22  12,23.67 90 top
R23  42,47.17 270 top
R24  6.4,52.07 0 top
R25  6.4,54.07 0 top
R26  6.4,50.07 0 top
T1  47.4,11.57 90 top
T2  55.9,12.57 180 top
T3  47.4,25.77 90 top
T4  55.9,26.77 180 top
T5  47.4,39.97 90 top
T6  55.9,40.97 180 top
T7  16.1,12.27 270 top
X1  64.2,11.77 0 top
X2  64.2,22.77 0 top
X3  64.2,33.77 0 top
X4  4.4,16.47 0 top
X5  4.4,30.27 90 top
X6  15.6,51.67 90 top
X7  62.23,3.81 0 bottom
X8  50.8,3.81 0 top
X9  44.45,3.81 0 bottom
X10  33.02,3.81 0 top
X11  62.23,52.07 0 bottom
X12  45.72,52.07 0 top
X13  40.39,52.06 0 bottom
X14  23.88,52.06 0 top
X15  68.5,45.07 270 top

### Tracks (layer width: path | path; a pad name or v marks a point on that pad's centre or on a via)
A_3V  (via drill 0.6)
  Top 1.016: X10.2 35.56,2.13 v35.55,1.97
  Bottom 1.016: v35.55,1.97 35.56,2.13 X10.2
A_5V  (via drill 0.6)
  Top 1.016: v38.1,5.17 X10.3
  Bottom 1.016: X10.3 v38.1,5.17
A_A0  (via drill 0.6)
  Top 1.016: v50.8,5.67 X8.1
  Bottom 1.016: X8.1 v50.8,5.67
A_A1  (via drill 0.6)
  Top 1.016: X8.2 53.34,2.01 v53.3,1.97
  Bottom 1.016: v53.3,1.97 53.34,2.01 X8.2
A_A2  (via drill 0.6)
  Top 1.016: v55.9,5.67 55.88,5.55 X8.3
  Bottom 1.016: X8.3 55.88,5.55 v55.9,5.67
A_A3  (via drill 0.6)
  Top 1.016: X8.4 58.42,1.99 v58.4,1.97
  Bottom 1.016: v58.4,1.97 58.42,1.99 X8.4
A_A4  (via drill 0.6)
  Top 1.016: v61,5.67 60.96,5.43 X8.5
  Bottom 1.016: X8.5 60.96,5.43 v61,5.67
A_A5  (via drill 0.6)
  Top 1.016: X8.6 v63.5,1.97
  Bottom 1.016: v63.5,1.97 X8.6
A_AREF  (via drill 0.6)
  Top 1.016: X13.8 23.88,53.87 v23.9,53.87
  Bottom 1.016: v23.9,53.87 23.88,53.87 X13.8
A_D0  (via drill 0.6)
  Top 1.016: v63.5,50.27 X12.8
  Bottom 1.016: X12.8 v63.5,50.27
A_D1  (via drill 0.6)
  Top 1.016: X12.7 60.96,53.87 v61,53.87
  Bottom 1.016: v61,53.87 60.96,53.87 X12.7
A_D2  (via drill 0.6)
  Top 1.016: v58.4,50.27 58.42,50.27 X12.6
  Bottom 1.016: X12.6 58.42,50.27 v58.4,50.27
A_D3  (via drill 0.6)
  Top 1.016: X12.5 55.88,53.87 v55.9,53.87
  Bottom 1.016: v55.9,53.87 55.88,53.87 X12.5
A_D9  (via drill 0.6)
  Top 1.016: v39.15,53.87 39.12,53.77 X13.2
  Bottom 1.016: X13.2 39.12,53.77 v39.15,53.87
A_D10  (via drill 0.6)
  Top 1.016: X13.3 36.6,53.33 v36.6,50.27
  Bottom 1.016: v36.6,50.27 36.6,53.33 X13.3
A_RESET  (via drill 0.3)
  Top 0.305: D5.C 30.45,2.37 v31.8,2.37 33.02,2.37 X10.1
  Bottom 0.305: X10.1 33.02,2.37 v31.8,2.37
A_VIN  (via drill 0.6)
  Top 1.016: X10.6 45.72,2.09 v45.7,1.97
  Bottom 1.016: v45.7,1.97 45.72,2.09 X10.6
AUTO_ADDR_ADC  (via drill 0.3)
  Top 0.305: IC1.31 19.15,44.72 20.2,45.77 20.8,45.77 21.5,46.47 v21.5,46.97 | R23.2 42.05,46.32 43,47.27 43,49.87 v42.4,50.47
  MiddleDown 0.305: v42.4,50.47 40.6,48.47 23,48.47 v21.5,46.97
  Bottom 0.305: v42.4,50.47 41.66,51.21 X13.1
AUTO_ADDR_GND
  Top 0.305: IC1.18 23.85,39.22 24.3,39.67 25.3,39.67 26.4,40.77 26.4,43.27 31,47.87 41.75,47.87 R23.1 41.66,48.27 X14.8
CCPOS0  (via drill 0.3)
  Top 0.305: IC1.29 20.15,43.92 v20.5,44.27
  MiddleDown 0.305: X15.6 63.61,41.47 27.8,41.47 26.1,43.17 21.4,43.17 20.5,44.07 v20.5,44.27
CCPOS1  (via drill 0.3)
  Top 0.305: IC1.27 21.15,44.12 v21.3,44.27
  MiddleDown 0.305: X15.4 64.67,45.04 63.3,43.67 21.9,43.67 v21.3,44.27
CCPOS2  (via drill 0.3)
  Top 0.305: IC1.30 19.65,44.42 20.3,45.07 v20.9,45.07
  MiddleDown 0.305: X15.2 64.64,47.61 63.3,46.27 61.6,46.27 59.5,44.17 22.4,44.17 21.5,45.07 v20.9,45.07
CHIP_SEL1  (via drill 0.3, 0.6)
  Top 0.305: IC1.35 17.15,44.52 v16.9,44.77
  Top 1.016: v53.3,50.27 53.34,50.47 X12.4
  MiddleDown 0.305: v16.9,44.77 18.4,46.27 21.9,46.27 23,45.17 49.4,45.17 53.3,49.07 v53.3,50.27
  Bottom 1.016: X12.4 53.34,50.47 v53.3,50.27
CHIP_SEL2  (via drill 0.3, 0.6)
  Top 0.305: IC1.21 24.65,40.72 25,41.07 v25,45.87 25,46.87 22.9,48.97 22.9,49.87 20.8,51.97 14.7,51.97 14.33,52.34 X6.4 14.33,54.6
  Top 1.016: X12.3 v50.8,53.87
  MiddleDown 0.305: v50.8,53.87 50.8,51.47 48.7,49.37 45.4,49.37 43.3,47.27 26.4,47.27 v25,45.87
  Bottom 0.305: 50.8,49.97 X12.3
  Bottom 1.016: v50.8,53.87 X12.3
CHIP_SEL3  (via drill 0.3, 0.6)
  Top 0.305: IC1.23 23.65,41.72 24.2,42.27 v24.2,46.67
  Top 1.016: v48.3,50.27 48.26,50.27 X12.2
  MiddleDown 0.305: v48.3,50.27 45.5,50.27 43.1,47.87 25.4,47.87 v24.2,46.67
  Bottom 1.016: X12.2 48.26,50.37 v48.3,50.27
CHIP_SEL4  (via drill 0.3, 0.6)
  Top 0.305: IC1.32 18.65,45.02 19.9,46.27 20.4,46.27 20.8,46.67 v20.8,47.67 | 45.72,50.19 X12.1
  Top 1.016: 45.72,50.19 45.7,50.07 | X12.1 45.7,50.8 v45.7,53.87
  MiddleDown 0.305: v45.7,53.87 45.6,53.77 44.7,53.77 40,49.07 22.2,49.07 v20.8,47.67
  Bottom 1.016: v45.7,53.87 45.7,50.8 X12.1
CP1H
  Top 0.305: 15.75,36.72 IC1.48 15.65,36.72 15.2,36.27 15.2,35.02 13.95,33.77 C1.2
CP1L
  Top 0.305: IC1.1 16.65,35.52 15.65,34.52 C1.1
CP2H
  Top 0.305: IC1.3 17.65,34.92 17.2,34.47 17.2,32.47 16.4,31.67 16.4,30.72 C4.1
CP2L
  Top 0.305: 18,30.92 C4.2 18.05,30.72 17.8,31.07 17.8,34.27 18.15,34.62 IC1.4
GH1  (via drill 0.3)
  Top 0.305: IC1.9 20.65,34.62 v21.1,34.17 | R4.2 C18.1 | C15.2 46.85,15.67 C18.1 | C18.1 48.05,14.77 48.93,14.77 T1.4 50.2,13.5 v50.2,14.37
  Middle 0.305: v21.1,34.17 21.8,33.47 21.8,32.07 23.5,30.37 v23.5,22.17
  MiddleDown 0.305: v50.2,14.37 31,14.37 23.5,21.87 v23.5,22.17
GH2  (via drill 0.3)
  Top 0.305: IC1.7 19.65,33.02 v20.1,32.57 | R9.2 C26.1 | C23.2 45.8,30.92 | C23.2 45.5,31.17 46.8,29.87 C26.1 | C26.1 48.05,28.97 48.93,28.97 T3.4 | C23.2 v45.5,32.27
  MiddleDown 0.305: v20.1,32.57 21.9,30.77 44,30.77 v45.5,32.27
GH3  (via drill 0.3)
  Top 0.305: IC1.5 18.65,34.12 v18.5,33.97 | R14.2 C34.1 | R14.2 48.45,42.77 49.3,42.77 50.2,41.88 T5.4 | R14.2 46.85,44.07 C31.2 v45.5,46.47
  Middle 0.305: v27.1,38.37 35.2,46.47 v45.5,46.47
  MiddleDown 0.305: v27.1,38.37 23.6,34.87 19.4,34.87 v18.5,33.97
GL1  (via drill 0.3)
  Top 0.305: IC1.13 23.95,36.72 v24.2,36.47 | R7.2 C21.1 51.95,15.97 C20.2 | C20.2 51.95,15.52 | C20.2 v53.1,15.67 53.92,15.67 T2.4
  Middle 0.305: v24.2,36.47 v24.2,22.87
  MiddleDown 0.305: v53.1,15.67 30.5,15.67 24.2,21.97 v24.2,22.87
GL2  (via drill 0.3)
  Top 0.305: IC1.12 22.15,35.72 22.6,35.27 25.9,35.27 v26.6,34.57 | C28.2 52.12,29.57 | C28.2 51.95,29.72 | C28.2 51.95,30.17 C29.1 R12.2 50.25,32.92 v50.3,32.87 | C28.2 53.99,29.87 T4.4
  MiddleDown 0.305: v26.6,34.57 48.6,34.57 v50.3,32.87
GL3  (via drill 0.3)
  Top 0.305: IC1.11 21.65,35.42 22.5,34.57 v25.6,34.57 | R17.2 50.25,47.07 | 50.25,47.07 C37.1 51.95,44.37 C36.2 51.95,44.02 53.99,44.02 T6.4 | v50.3,47.07 50.25,47.07
  Middle 0.305: v25.6,34.57 36.4,45.37 48.6,45.37 v50.3,47.07
GND  (via drill 0.3, 0.6)
  Top 0.305: 17.4,39.47 17.15,39.72 IC1.42 12.8,39.72 C5.1 | IC1.19 21.65,39.72 21.4,39.47 | IC1.28 20.65,41.72 | IC1.39 14.85,41.22 14,42.07 14,44.27 13.4,44.87 12.4,44.87 | 12.4,44.87 11.2,44.87 11,45.07 11,48.27 11.4,48.67 v12,48.67 | C11.1 12.65,44.62 12.4,44.87 | C17.- 31.35,39.47 30,39.47 30,29.97 v29.7,29.77 | C16.2 D3.A 48.3,35.87 v48.8,35.37 | v48.8,21.17 48.3,21.67 D2.A C24.2
  Top 1.016: v26.4,50.27 26.42,50.37 X13.7 | X10.5 43.2,2.56 v43.2,5.67 | X10.4 40.64,2.03 v40.65,1.97
  Bottom 1.016: X13.7 26.42,50.37 v26.4,50.27 | v43.2,5.67 43.2,2.56 X10.5 | v40.65,1.97 40.64,2.03 X10.4
  other vias: 19.4,39.47 10.6,36.67 19.1,49.87 18.4,22.97 19.2,22.17 17.6,20.57 17.6,24.57 16.8,22.17 17.6,22.17 19.2,23.77 17.6,23.77 16.8,20.57 16.8,23.77 19.2,20.57 18.4,21.37 16.8,24.57 18.4,23.77 18.4,22.17 17.6,22.97 19.2,22.97 19.2,21.37 28.8,29.77 28.8,28.87 18.4,20.57 17.6,21.37 23.5,31.47 43.7,50.47 16.8,21.37 9.4,43.87 16.8,22.97 19.2,24.57 18.4,24.57 27.8,42.77 28.2,1.87 18.5,39.47 17.6,39.47 19.4,38.57 19.4,37.67 18.5,38.57 17.6,38.57 17.6,37.67 18.5,37.67 20.3,37.67 21.2,37.67 20.3,38.57 21.2,38.57 21.2,39.47 20.3,39.47 17.6,40.37 17.6,41.27 18.5,40.37 19.4,40.37 20.3,40.37 21.2,40.37 18.5,41.27 19.4,41.27 20.3,41.27 21.2,41.27
  pour Top (isolate 0.254, rank 6, no thermals): 0,-0.23 0,55.77 64,55.77 66,53.77 66,41.77 68.5,39.27 68.5,6.27 66,3.77 66,-0.23
  pour Bottom (isolate 0.254, rank 6, no thermals): 0,-0.23 0,55.77 64,55.77 66,53.77 66,41.77 68.5,39.27 68.5,6.27 66,3.77 66,-0.23
  pour Middle (isolate 0.254, rank 6, no thermals): 0,0.07 0,55.87 64,55.87 66,53.87 66,41.67 68.6,39.07 68.6,6.27 66.2,3.87 66.2,0.07
  pour MiddleDown (isolate 0.254, rank 2, no thermals): 0,55.87 0,-0.03 66,-0.03 66,3.77 68.6,6.37 68.6,39.07 66,41.67 66,53.87 64,55.87
GND_REF
  Top 0.305: IC1.33 18.15,45.32 19.4,46.57 19.4,47.32 C10.1
LIN  (via drill 0.3)
  Top 0.305: IC1.43 13.75,39.22 13.4,38.87 11.95,38.87 C5.2 10.2,39.12 v10.2,38.87
  Middle 0.305: v10.2,38.87 10.2,51.97 LSP1.MP
  Bottom 0.305: 10.3,38.97 v10.2,38.87
MON
  Top 0.305: IC1.14 25,37.22 C6.2 25.73,36.74
N$1
  Top 0.305: C19.1 R3.1
N$2
  Top 0.305: R6.1 C22.1
N$3
  Top 0.305: R25.1 5.55,53.82 4.55,53.82 4.2,53.47 LED2.2
N$4
  Top 0.305: C27.1 R8.1
N$5
  Top 0.305: 55.1,33.77 C30.1 R11.1
N$6
  Top 0.305: R16.1 C38.1
N$7
  Top 0.305: R13.1 C35.1
N$9
  Top 0.305: R24.1 3.6,52.07 3.3,52.37 LED2.1
N$10
  Top 0.305: LED2.3 4.2,50.57 4.7,50.07 R26.1
N$12  (via drill 0.3)
  Top 0.305: R21.2 13.4,28.42 14.6,27.27 v14.6,16.37 | v13.3,9.17 13.3,9.87 13.3,10.33 T7.4
  Middle 0.305: v14.6,16.37 14.6,10.47 v13.3,9.17
N$51
  Top 0.305: R22.1 LED1.C
OP1  (via drill 0.3)
  Top 0.305: 16.05,47.32 C39.2 | C39.2 15.75,47.32 15.75,47.22 | IC1.37 15.45,42.22 15,42.67 v15,46.67 15.85,47.52 C39.2 | R20.1 23.05,26.02 | 23.2,25.82 R20.1 | R20.1 23,25.72 23,26.77 20.9,28.87 20.6,28.87 v19.9,29.57
  Middle 0.305: v15,46.67 15.4,46.27 15.4,34.07 v19.9,29.57
OP2  (via drill 0.3)
  Top 0.305: IC1.36 16.65,44.02 16,44.67 C39.1 16.85,46.67 v17,46.67 | v20.9,29.57 24.2,26.27 24.2,25.82 R18.1
  Middle 0.305: v17,46.67 16.6,46.67 15.9,45.97 15.9,34.27 19.9,30.27 20.2,30.27 v20.9,29.57
PHASE1
  Top 0.305: 53,14.27 53.3,13.97 | C19.2 R4.1 C18.2 C20.1 50.25,15.32 51.3,14.27 | R6.2 58.15,19.52 58.5,19.17 58.5,14.07 58.4,13.97 | R5.1 49.7,7.27
  pour Top (isolate 0.254, no thermals): 49.5,12.67 51.3,12.67 51.3,14.27 58.6,14.27 58.6,17.87 68.5,17.87 68.5,7.27 49.5,7.27
PHASE2
  Top 0.305: C27.2 R9.1 C26.2 C28.1 50.25,29.52 51.3,28.47 | R11.2 58.15,33.72 58.5,33.37 58.5,27.97
  pour Top (isolate 0.254, no thermals): 49.5,22.67 49.5,26.87 51.3,26.87 51.3,28.47 68.6,28.47 68.6,18.47 58.9,18.47 58.9,20.57 52.8,20.57 52.8,22.67
PHASE3
  Top 0.305: C35.2 C34.2 R14.1 C36.1 50.25,43.82 50.3,43.87 50.3,43.67 51.3,42.67 52.7,42.67 52.9,42.47 | R16.2 58.15,48.02 58.5,47.67 58.5,42.17
  Top 0.406: 48.85,43.82 R14.1
  pour Top (isolate 0.254, no thermals): 51.3,42.67 60.2,42.67 61.6,41.27 66.4,41.27 68.5,39.17 68.5,29.07 58.9,29.07 58.9,34.77 52.8,34.77 52.8,36.87 49.5,36.87 49.5,41.07 51.3,41.07
RESET  (via drill 0.3)
  Top 0.305: 29.22,4.79 C43.2 28.09,4.87 | 29.87,4.79 D5.A 30.4,4.79 29.22,4.79 | X6.10 18.14,52.97 | 18.14,52.97 18.14,52.93 | IC1.22 24.15,41.22 v24.3,41.37 | v19.1,52.97 18.14,52.97 | 29.22,4.79 v29.2,4.77
  Middle 0.305: v29.2,4.77 24.9,9.07 24.9,40.77 v24.3,41.37 22.4,43.27 22.4,50.37 19.8,52.97 v19.1,52.97
RGB_B  (via drill 0.3)
  Top 0.305: R26.2 v8.4,50.07 | IC1.26 21.65,43.62 22.4,44.37 22.4,47.07 v20.8,48.67
  MiddleDown 0.305: v8.4,50.07 17.9,50.07 18.8,49.17 20.3,49.17 v20.8,48.67
RGB_G  (via drill 0.3)
  Top 0.305: R25.2 v8.4,54.07 | IC1.24 23.35,42.22 23.5,42.37 23.5,47.57 22.4,48.67 22.4,49.37 v21.5,50.27
  MiddleDown 0.305: v8.4,54.07 10.4,54.07 13.4,51.17 20.6,51.17 v21.5,50.27
RGB_R  (via drill 0.3)
  Top 0.305: R24.2 v8.4,52.07 | IC1.25 22.15,43.32 22.9,44.07 22.9,47.37 21.9,48.37 21.9,48.87 v20.5,50.27 19.4,51.37 15.6,51.37 X6.5
  MiddleDown 0.305: v8.4,52.07 8.4,51.87 9.7,50.57 20.2,50.57 v20.5,50.27
SH1  (via drill 0.3)
  Top 0.305: IC1.8 20.15,34.12 21.1,33.17 v21.1,32.57 C9.2 | v22.8,16.77 22.8,12.57 27.85,7.52 D1.C | D1.C 28.5,7.32 | R5.2 28.55,7.27 D1.C
  Middle 0.305: v21.1,32.57 21.1,31.97 22.8,30.27 v22.8,16.77
SH2  (via drill 0.3)
  Top 0.305: 19.3,31 C8.2 19.15,30.67 19.15,32.67 | R10.2 D2.C 49.3,21.67 v48.8,22.17 | IC1.6 19.15,32.67 | v19.1,32.57 19.15,32.67
  MiddleDown 0.305: v19.1,32.57 24.2,27.47 43.5,27.47 v48.8,22.17
SH3  (via drill 0.3)
  Top 0.305: IC1.46 15.05,37.72 13.7,36.37 v13.7,35.77 13.4,35.47 C7.1 12.8,35.47 | R15.2 D3.C 49.3,35.87 v48.8,36.37
  MiddleDown 0.305: v13.7,35.77 16.2,33.27 22.9,33.27 26,36.37 v48.8,36.37
SL  (via drill 0.3)
  Top 0.305: IC1.10 21.15,35.12 22.4,33.87 24.4,33.87 25.8,32.47 25.8,25.92 R18.2
  other vias: 55,32.57 57.1,31.87 53.6,32.57 54.3,31.87 55,31.87 55,31.17 57.1,31.17 57.8,31.87 57.1,32.57 54.3,31.17 53.6,31.17 57.8,32.57 54.3,32.57 55.7,31.17 56.4,31.87 55.7,32.57 57.8,31.17 56.4,31.17 53.6,31.87 56.4,32.57 55.7,45.37 55,45.37 55,46.07 55,46.77 57.1,46.77 57.1,46.07 53.6,45.37 56.4,45.37 54.3,46.07 55.7,46.77 54.3,46.77 53.6,46.07 53.6,46.77 56.4,46.07 55.7,46.07 54.3,45.37 57.8,46.77 57.8,45.37 57.1,45.37 57.8,46.07 56.4,46.77 53.6,16.97 56.4,16.97 55.7,16.97 55,16.97 56.4,17.67 57.8,16.97 57.1,17.67 57.1,16.97 55.7,17.67 55,17.67 54.3,17.67 56.4,18.37 54.3,18.37 53.6,18.37 55.7,18.37 53.6,17.67 55.7,31.87 55,18.37 54.3,16.97 57.8,17.67 29.8,20.57 28.2,24.57 29,20.57 28.2,23.77 29,21.37 29,19.77 29.8,21.37 29.8,23.77 29.8,19.77 28.2,19.77 29,22.17 29,23.77 28.2,21.37 29,22.97 28.2,25.37 29,24.57 29.8,22.17 28.2,22.97 29.8,22.97 29.8,24.57 29,25.37 57.1,18.37 57.8,18.37 28.2,20.57 28.2,22.17 29.8,25.37
  pour Top (isolate 0.254, no thermals): 25.8,19.07 25.8,26.07 30.6,26.07 30.6,19.07
  pour Top (isolate 0.2, rank 2, no thermals): 54.7,43.17 54.7,44.57 54.5,44.77 51.5,44.77 51.5,48.47 53.8,48.47 53.8,47.07 58,47.07 58,43.17
  pour Top (isolate 0.2, rank 2, no thermals): 58,28.97 58,32.87 53.8,32.87 53.8,34.17 51.5,34.17 51.5,30.37 54.6,30.37 54.6,28.97
  pour Top (isolate 0.2, rank 2, no thermals): 58,14.77 58,18.67 53.8,18.67 53.8,19.97 51.5,19.97 51.5,16.07 54.6,16.07 54.6,14.77
  pour Bottom (isolate 0.254, rank 2, no thermals): 60.5,16.67 27,16.67 27,25.67 50.1,48.77 60.5,48.77
SPI2_CLK  (via drill 0.3, 0.6)
  Top 0.305: v25.6,37.97 25.35,37.72 IC1.15
  Top 1.016: v28.95,53.87 v28.96,53.87 X13.6
  Middle 0.305: v25.6,37.97 26.4,38.77 26.4,44.87 28.95,47.42 v28.95,53.87
  Bottom 0.305: 29,50.75 X13.6
  Bottom 1.016: X13.6 v28.96,53.87 v28.95,53.87
SPI2_MRST  (via drill 0.3, 0.6)
  Top 0.305: IC1.17 24.15,38.72 24.6,39.17 25.6,39.17 27.1,40.67 v27.1,41.07
  Top 1.016: X13.5 v31.5,50.27
  Middle 0.305: v27.1,41.07 27.1,44.77 31.5,49.17 v31.5,50.27
  Bottom 1.016: v31.5,50.27 X13.5
SPI2_MTSR  (via drill 0.3, 0.6)
  Top 0.305: IC1.16 24.45,38.22 24.9,38.67 26.1,38.67 v27.1,39.67
  Top 1.016: v34.05,53.87 34.04,53.67 X13.4
  Middle 0.305: v27.1,39.67 28.5,41.07 28.5,45.37 34.04,50.91 34.04,51.37 34.05,51.38 v34.05,53.87
  Bottom 1.016: X13.4 34.04,53.67 v34.05,53.87
TMS  (via drill 0.3)
  Top 0.305: 13.06,54.53 X6.2 12.96,53.67 v12.2,53.67 | v25.7,41.07 25.7,40.97 24.95,40.22 IC1.20
  Middle 0.305: v25.7,41.07 22.9,43.87 22.9,50.67 19.9,53.67 v12.2,53.67
VAREF
  Top 0.305: IC1.34 17.65,45.62 18,45.97 18,47.22 C10.2
VBAT
  pour Top (isolate 0.254, no thermals): 0,11.07 0,23.27 14,23.27 14,11.07
VCP
  Top 0.305: 14.8,30.82 C3.1 | C3.1 15.05,31.22 16.6,32.77 16.6,34.67 17.15,35.22 IC1.2 | C3.1 R21.1
VDDC
  Top 0.305: IC1.38 15.15,41.72 14.5,42.37 14.5,44.57 14,45.07 C14.2 C13.2
VDDEXT  (via drill 0.3)
  Top 0.305: IC1.41 14.25,40.22 13.6,40.87 v11.8,40.87
  MiddleDown 0.305: v11.8,40.87 15,44.07 18.9,44.07 20.6,45.77 21.6,45.77 22.7,44.67 59.19,44.67 X15.1
VDDP
  Top 0.305: C12.2 13,41.82 | IC1.40 14.55,40.72 13.4,41.87 C12.2 | 12.86,49.57 X6.1 12.96,49.67 12.83,49.55 11.53,49.55 10.4,48.42 | 10.4,48.42 10.4,44.52 C11.2 12.65,42.17 C12.2 | 10.4,48.42 9.75,49.07 4.8,49.07 3.3,50.57 LED2.4
VDH  (via drill 0.3)
  Top 0.305: 11.2,37.82 R2.2 10.6,37.87 9.8,37.07 v9.8,35.87 8.3,35.87 D4.A | C3.2 13.35,31.42 v13.8,31.87 12.65,33.02 R1.2 | R13.2 44.05,47.32 44,47.27
  Middle 0.305: v22.1,15.07 22.1,26.37 16.6,31.87 v13.8,31.87 v9.8,35.87
  other vias: 37.2,12.27 36.4,12.27 35.6,12.27 34.8,12.27 34,12.27 33.2,12.27 32.4,12.27 32.4,11.47 33.2,11.47 34,11.47 34.8,11.47 35.6,11.47 36.4,11.47 37.2,11.47 37.2,13.07 36.4,13.07 35.6,13.07 34.8,13.07 34,13.07 33.2,13.07 32.4,13.07 38.8,11.47 38,11.47 38,12.27 38,13.07 38.8,12.27 38.8,13.07 22.1,9.47 20.5,10.27 20.5,9.47 20.5,12.67 20.5,13.47 20.5,14.27 20.5,15.07 21.3,11.07 20.5,11.07 22.1,11.07 21.3,15.07 21.3,14.27 22.1,14.27 22.1,13.47 21.3,13.47 21.3,12.67 22.1,12.67 21.3,10.27 21.3,9.47 22.1,10.27 22.1,11.87 21.3,11.87 20.5,11.87
  pour Top (isolate 0.254, rank 2, no thermals): 31.2,10.27 31.2,47.27 49,47.27 49,7.87 41,7.87 41,9.27 40,10.27
  pour Bottom (no thermals): 19,6.07 19,16.07 39.6,16.07 39.6,6.07
  pour Top (isolate 0.254, rank 2, no thermals): 22.3,15.67 14.4,15.67 14.5,8.87 22.4,8.87
VDH_CHIP
  Top 0.305: IC1.44 14.45,38.72 13.6,37.87 R2.1
VS  (via drill 0.3)
  Top 0.305: C41.1 7.62,43.9 C42.+ | C41.1 9.85,41.52 | IC1.45 14.75,38.22 13.2,36.67 v11.8,36.67 | C41.1 9.5,41.62 v9.5,39.87 D4.C
  Middle 0.305: v9.5,39.87 9.5,38.37 10,37.87 10.6,37.87 v11.8,36.67
VSD
  Top 0.305: IC1.47 15.35,37.22 14.6,36.47 14.6,35.47 13.6,34.47 12,34.47 11.15,33.62 R1.1 10.95,31.37 C2.1

### Text on the board
tNames: LIN | L3 | GND | L2 | 12V | L1 | Embedded Power IC / BLDC Shield with TLE9879QXA40